# Altium schematic sheet car_msp_breakouts.SchDoc
size A; PageSetup: Record=PageOptions|CenterHorizontal=True|CenterVertical=True|PrintScale=1.12|XCorrection=1.00|YCorrection=1.00|PrintKind=1|BorderSize=5000000|LeftOffset=0|BottomOffset=0|Orientation=2|PaperLength=1000|PaperWidth=1000|Scale=100|PaperSource=7|PrintQuality=600|MediaType=1|DitherType=10|PrintScaleMode=1|PaperKind=Letter|PaperIndex=1
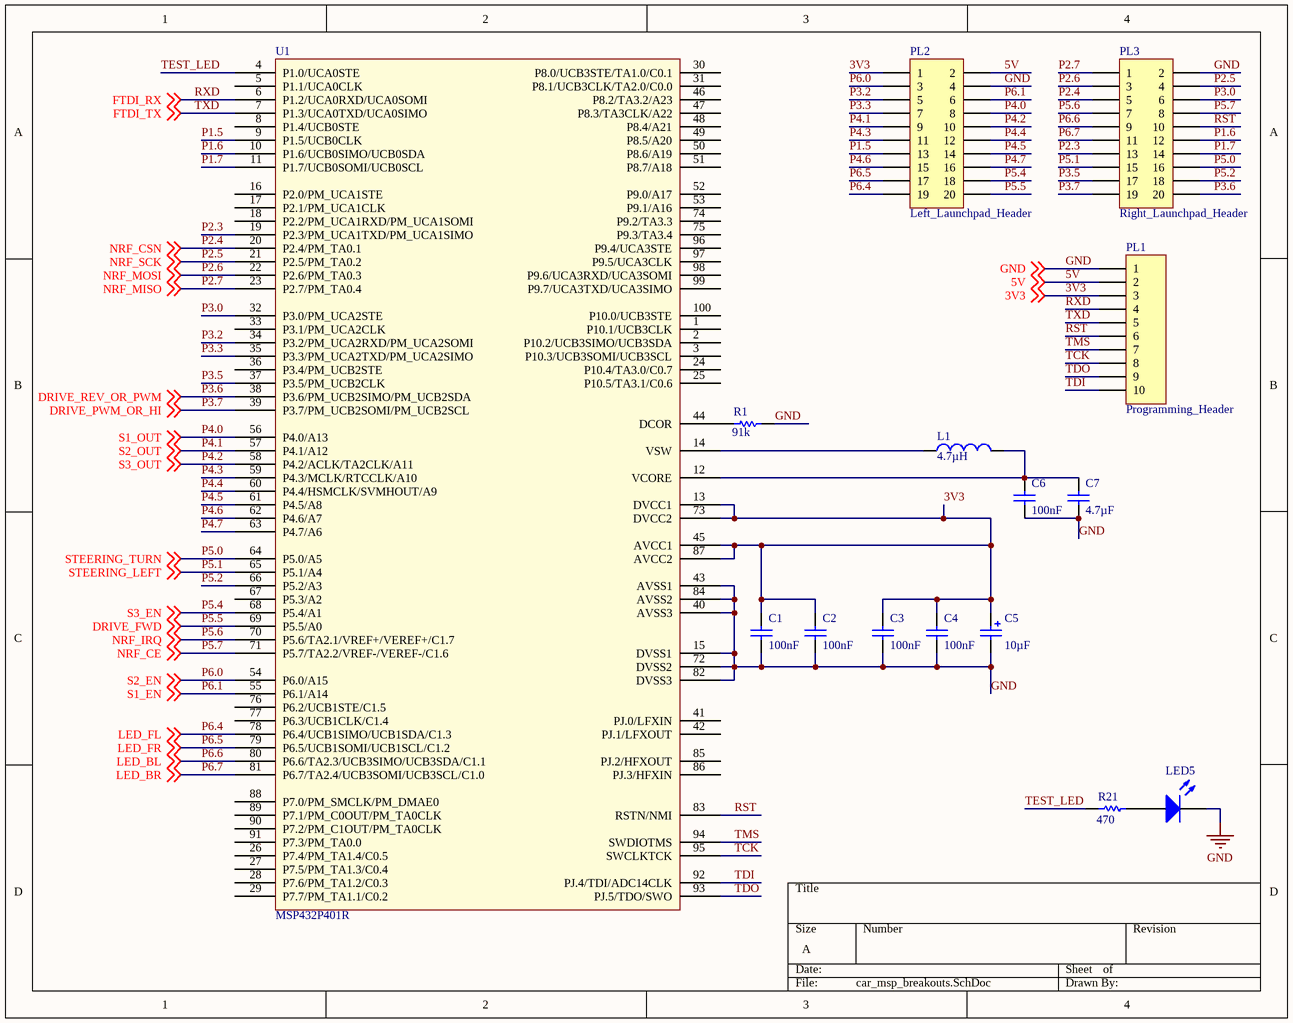
[diagram p0: car_msp_breakouts.SchDoc]

## Parts
C1  value 100nF  [0805-C]  (hidden comment: Cap)
C2  value 100nF  [0805-C]  (hidden comment: Cap)
C3  value 100nF  [0805-C]  (hidden comment: Cap)
C4  value 100nF  [0805-C]  (hidden comment: Cap)
C5  value 10µF  [0805-TC]  (hidden comment: Cap Pol1)
C6  value 100nF  [0805-C]  (hidden comment: Cap)
C7  value 4.7µF  [0805-C]  (hidden comment: Cap)
L1  value 4.7µH  [0805-L]  (hidden comment: Inductor)
LED5  LED2  [0805-LED]  (value not drawn)
PL1  Programming_Header  [HDR1X10]
PL2  Left_Launchpad_Header  [HDR2X10]
PL3  Right_Launchpad_Header  [HDR2X10]
R1  value 91k  [0805-R]  (hidden comment: Res1)
R21  value 470  [0805-R]  (hidden comment: Res1)
U1  MSP432P401R  [TSQFP50P1600X1600X160-100N]

## Nets
GND: C1.1 C2.1 C3.1 C4.1 C5.2 C6.1 C7.1 LED5.2(K) PL1.1 PL2.4 PL3.2 R1.2 U1.15(DVSS1) U1.40(AVSS3) U1.43(AVSS1) U1.72(DVSS2) U1.82(DVSS3) U1.84(AVSS2) ; off-sheet GND
3V3: C1.2 C2.2 C3.2 C4.2 C5.1 PL1.3 PL2.1 U1.13(DVCC1) U1.45(AVCC1) U1.73(DVCC2) U1.87(AVCC2) ; off-sheet 3V3
5V: PL1.2 PL2.2 ; off-sheet 5V
P1.5: PL2.13 U1.9(P1.5/UCB0CLK)
P1.6: PL3.12 U1.10(P1.6/UCB0SIMO/UCB0SDA)
P1.7: PL3.14 U1.11(P1.7/UCB0SOMI/UCB0SCL)
P2.3: PL3.13 U1.19(P2.3/PM_UCA1TXD/PM_UCA1SIMO)
P2.4: PL3.5 U1.20(P2.4/PM_TA0.1) ; off-sheet NRF_CSN  [also labelled NRF_CSN]
P2.5: PL3.4 U1.21(P2.5/PM_TA0.2) ; off-sheet NRF_SCK  [also labelled NRF_SCK]
P2.6: PL3.3 U1.22(P2.6/PM_TA0.3) ; off-sheet NRF_MOSI  [also labelled NRF_MOSI]
P2.7: PL3.1 U1.23(P2.7/PM_TA0.4) ; off-sheet NRF_MISO  [also labelled NRF_MISO]
P3.0: PL3.6 U1.32(P3.0/PM_UCA2STE)
P3.2: PL2.5 U1.34(P3.2/PM_UCA2RXD/PM_UCA2SOMI)
P3.3: PL2.7 U1.35(P3.3/PM_UCA2TXD/PM_UCA2SIMO)
P3.5: PL3.17 U1.37(P3.5/PM_UCB2CLK)
P3.6: PL3.20 U1.38(P3.6/PM_UCB2SIMO/PM_UCB2SDA) ; off-sheet DRIVE_REV_OR_PWM  [also labelled DRIVE_REV_OR_PWM]
P3.7: PL3.19 U1.39(P3.7/PM_UCB2SOMI/PM_UCB2SCL) ; off-sheet DRIVE_PWM_OR_HI  [also labelled DRIVE_PWM_OR_HI]
P4.0: PL2.8 U1.56(P4.0/A13) ; off-sheet S1_OUT  [also labelled S1_OUT]
P4.1: PL2.9 U1.57(P4.1/A12) ; off-sheet S2_OUT  [also labelled S2_OUT]
P4.2: PL2.10 U1.58(P4.2/ACLK/TA2CLK/A11) ; off-sheet S3_OUT  [also labelled S3_OUT]
P4.3: PL2.11 U1.59(P4.3/MCLK/RTCCLK/A10)
P4.4: PL2.12 U1.60(P4.4/HSMCLK/SVMHOUT/A9)
P4.5: PL2.14 U1.61(P4.5/A8)
P4.6: PL2.15 U1.62(P4.6/A7)
P4.7: PL2.16 U1.63(P4.7/A6)
P5.0: PL3.16 U1.64(P5.0/A5) ; off-sheet STEERING_TURN  [also labelled STEERING_TURN]
P5.1: PL3.15 U1.65(P5.1/A4) ; off-sheet STEERING_LEFT  [also labelled STEERING_LEFT]
P5.2: PL3.18 U1.66(P5.2/A3)
P5.4: PL2.18 U1.68(P5.4/A1) ; off-sheet S3_EN  [also labelled S3_EN]
P5.5: PL2.20 U1.69(P5.5/A0) ; off-sheet DRIVE_FWD  [also labelled DRIVE_FWD]
P5.6: PL3.7 U1.70(P5.6/TA2.1/VREF+/VEREF+/C1.7) ; off-sheet NRF_IRQ  [also labelled NRF_IRQ]
P5.7: PL3.8 U1.71(P5.7/TA2.2/VREF-/VEREF-/C1.6) ; off-sheet NRF_CE  [also labelled NRF_CE]
P6.0: PL2.3 U1.54(P6.0/A15) ; off-sheet S2_EN  [also labelled S2_EN]
P6.1: PL2.6 U1.55(P6.1/A14) ; off-sheet S1_EN  [also labelled S1_EN]
P6.4: PL2.19 U1.78(P6.4/UCB1SIMO/UCB1SDA/C1.3) ; off-sheet LED_FL  [also labelled LED_FL]
P6.5: PL2.17 U1.79(P6.5/UCB1SOMI/UCB1SCL/C1.2) ; off-sheet LED_FR  [also labelled LED_FR]
P6.6: PL3.9 U1.80(P6.6/TA2.3/UCB3SIMO/UCB3SDA/C1.1) ; off-sheet LED_BL  [also labelled LED_BL]
P6.7: PL3.11 U1.81(P6.7/TA2.4/UCB3SOMI/UCB3SCL/C1.0) ; off-sheet LED_BR  [also labelled LED_BR]
RST: PL1.6 PL3.10 U1.83(RSTN/NMI)
RXD: PL1.4 U1.6(P1.2/UCA0RXD/UCA0SOMI) ; off-sheet FTDI_RX  [also labelled FTDI_RX]
TCK: PL1.8 U1.95(SWCLKTCK)
TDI: PL1.10 U1.92(PJ.4/TDI/ADC14CLK)
TDO: PL1.9 U1.93(PJ.5/TDO/SWO)
TEST_LED: R21.1 U1.4(P1.0/UCA0STE)
TMS: PL1.7 U1.94(SWDIOTMS)
TXD: PL1.5 U1.7(P1.3/UCA0TXD/UCA0SIMO) ; off-sheet FTDI_TX  [also labelled FTDI_TX]
NetC6_2: C6.2 C7.2 L1.2 U1.12(VCORE)
NetL1_1: L1.1 U1.14(VSW)
NetLED5_1: LED5.1(A) R21.2
NetR1_1: R1.1 U1.44(DCOR)

Not connected (* = marked no-connect by the designer): U1 1(P10.1/UCB3CLK) 2(P10.2/UCB3SIMO/UCB3SDA) 3(P10.3/UCB3SOMI/UCB3SCL) 5(P1.1/UCA0CLK) 8(P1.4/UCB0STE) 16(P2.0/PM_UCA1STE) 17(P2.1/PM_UCA1CLK) 18(P2.2/PM_UCA1RXD/PM_UCA1SOMI) 24(P10.4/TA3.0/C0.7) 25(P10.5/TA3.1/C0.6) 26(P7.4/PM_TA1.4/C0.5) 27(P7.5/PM_TA1.3/C0.4) 28(P7.6/PM_TA1.2/C0.3) 29(P7.7/PM_TA1.1/C0.2) 30(P8.0/UCB3STE/TA1.0/C0.1) 31(P8.1/UCB3CLK/TA2.0/C0.0) 33(P3.1/PM_UCA2CLK) 36(P3.4/PM_UCB2STE) 41(PJ.0/LFXIN) 42(PJ.1/LFXOUT) 46(P8.2/TA3.2/A23) 47(P8.3/TA3CLK/A22) 48(P8.4/A21) 49(P8.5/A20) 50(P8.6/A19) 51(P8.7/A18) 52(P9.0/A17) 53(P9.1/A16) 67(P5.3/A2) 74(P9.2/TA3.3) 75(P9.3/TA3.4) 76(P6.2/UCB1STE/C1.5) 77(P6.3/UCB1CLK/C1.4) 85(PJ.2/HFXOUT) 86(PJ.3/HFXIN) 88(P7.0/PM_SMCLK/PM_DMAE0) 89(P7.1/PM_C0OUT/PM_TA0CLK) 90(P7.2/PM_C1OUT/PM_TA0CLK) 91(P7.3/PM_TA0.0) 96(P9.4/UCA3STE) 97(P9.5/UCA3CLK) 98(P9.6/UCA3RXD/UCA3SOMI) 99(P9.7/UCA3TXD/UCA3SIMO) 100(P10.0/UCB3STE)

## Library data of the parts
C1-C4 C6 C7 = Cap: Capacitor; Published: 8-Jun-2000; LatestRevisionDate: 17-Jul-2002; LatestRevisionNote: Re-released for DXP Platform.; PackageReference: RAD-0.3; Publisher: Altium Limited; PackageDescription: Radial Cap, Thru-Hole; 2 Leads; 0.3 in Pin Spacing
C5 = Cap Pol1: Polarized Capacitor (Radial); Published: 8-Jun-2000; LatestRevisionDate: 17-Jul-2002; LatestRevisionNote: Re-released for DXP Platform.; PackageReference: RB7.6-15; Publisher: Altium Limited; PackageDescription: Polarized Capacitor (Radial); 2 Leads
L1 = Inductor: Code_IEC: 1005; Published: 8-Jun-2000; LatestRevisionDate: 29-May-2009; LatestRevisionNote: IPC-7351 Footprint Added.; PackageReference: 0402-A; Publisher: Altium Limited; PackageDescription: Chip Inductor; Code_JEITA: 0402
LED5 = LED2: Typical RED, GREEN, YELLOW, AMBER GaAs LED; Published: 8-Jun-2000; LatestRevisionDate: 17-Jul-2002; LatestRevisionNote: Re-released for DXP Platform.; PackageVersion: Feb-2002; PackageReference: 3.2X1.6X1.1; Publisher: Altium Limited; PackageDescription: SM LED; 2 Flat Leads
PL1 = Header 10: Header, 10-Pin; LatestRevisionDate: 17-Jul-2002; LatestRevisionNote: Re-released for DXP Platform.; Publisher: Altium Limited
PL2 PL3 = Header 10X2: Header, 10-Pin, Dual row; LatestRevisionDate: 17-Jul-2002; LatestRevisionNote: Re-released for DXP Platform.; Publisher: Altium Limited
R1 R21 = Res1: Resistor; Published: 8-Jun-2000; LatestRevisionDate: 17-Jul-2002; LatestRevisionNote: Re-released for DXP Platform.; PackageReference: AXIAL-0.3; Publisher: Altium Limited; PackageDescription: Axial Device, Thru-Hole; 2 Leads; 0.3 in Pin Spacing
U1 = MSP432